# Altium project MainBoard.PrjPcb (part 2 of 2)

## Sheet MainBoard_PERIPH.SchDoc
size 594 x 420 mm; DocumentNumber: VSL.23-MOTHERBOARD; SheetNumber: 5; Format: A2
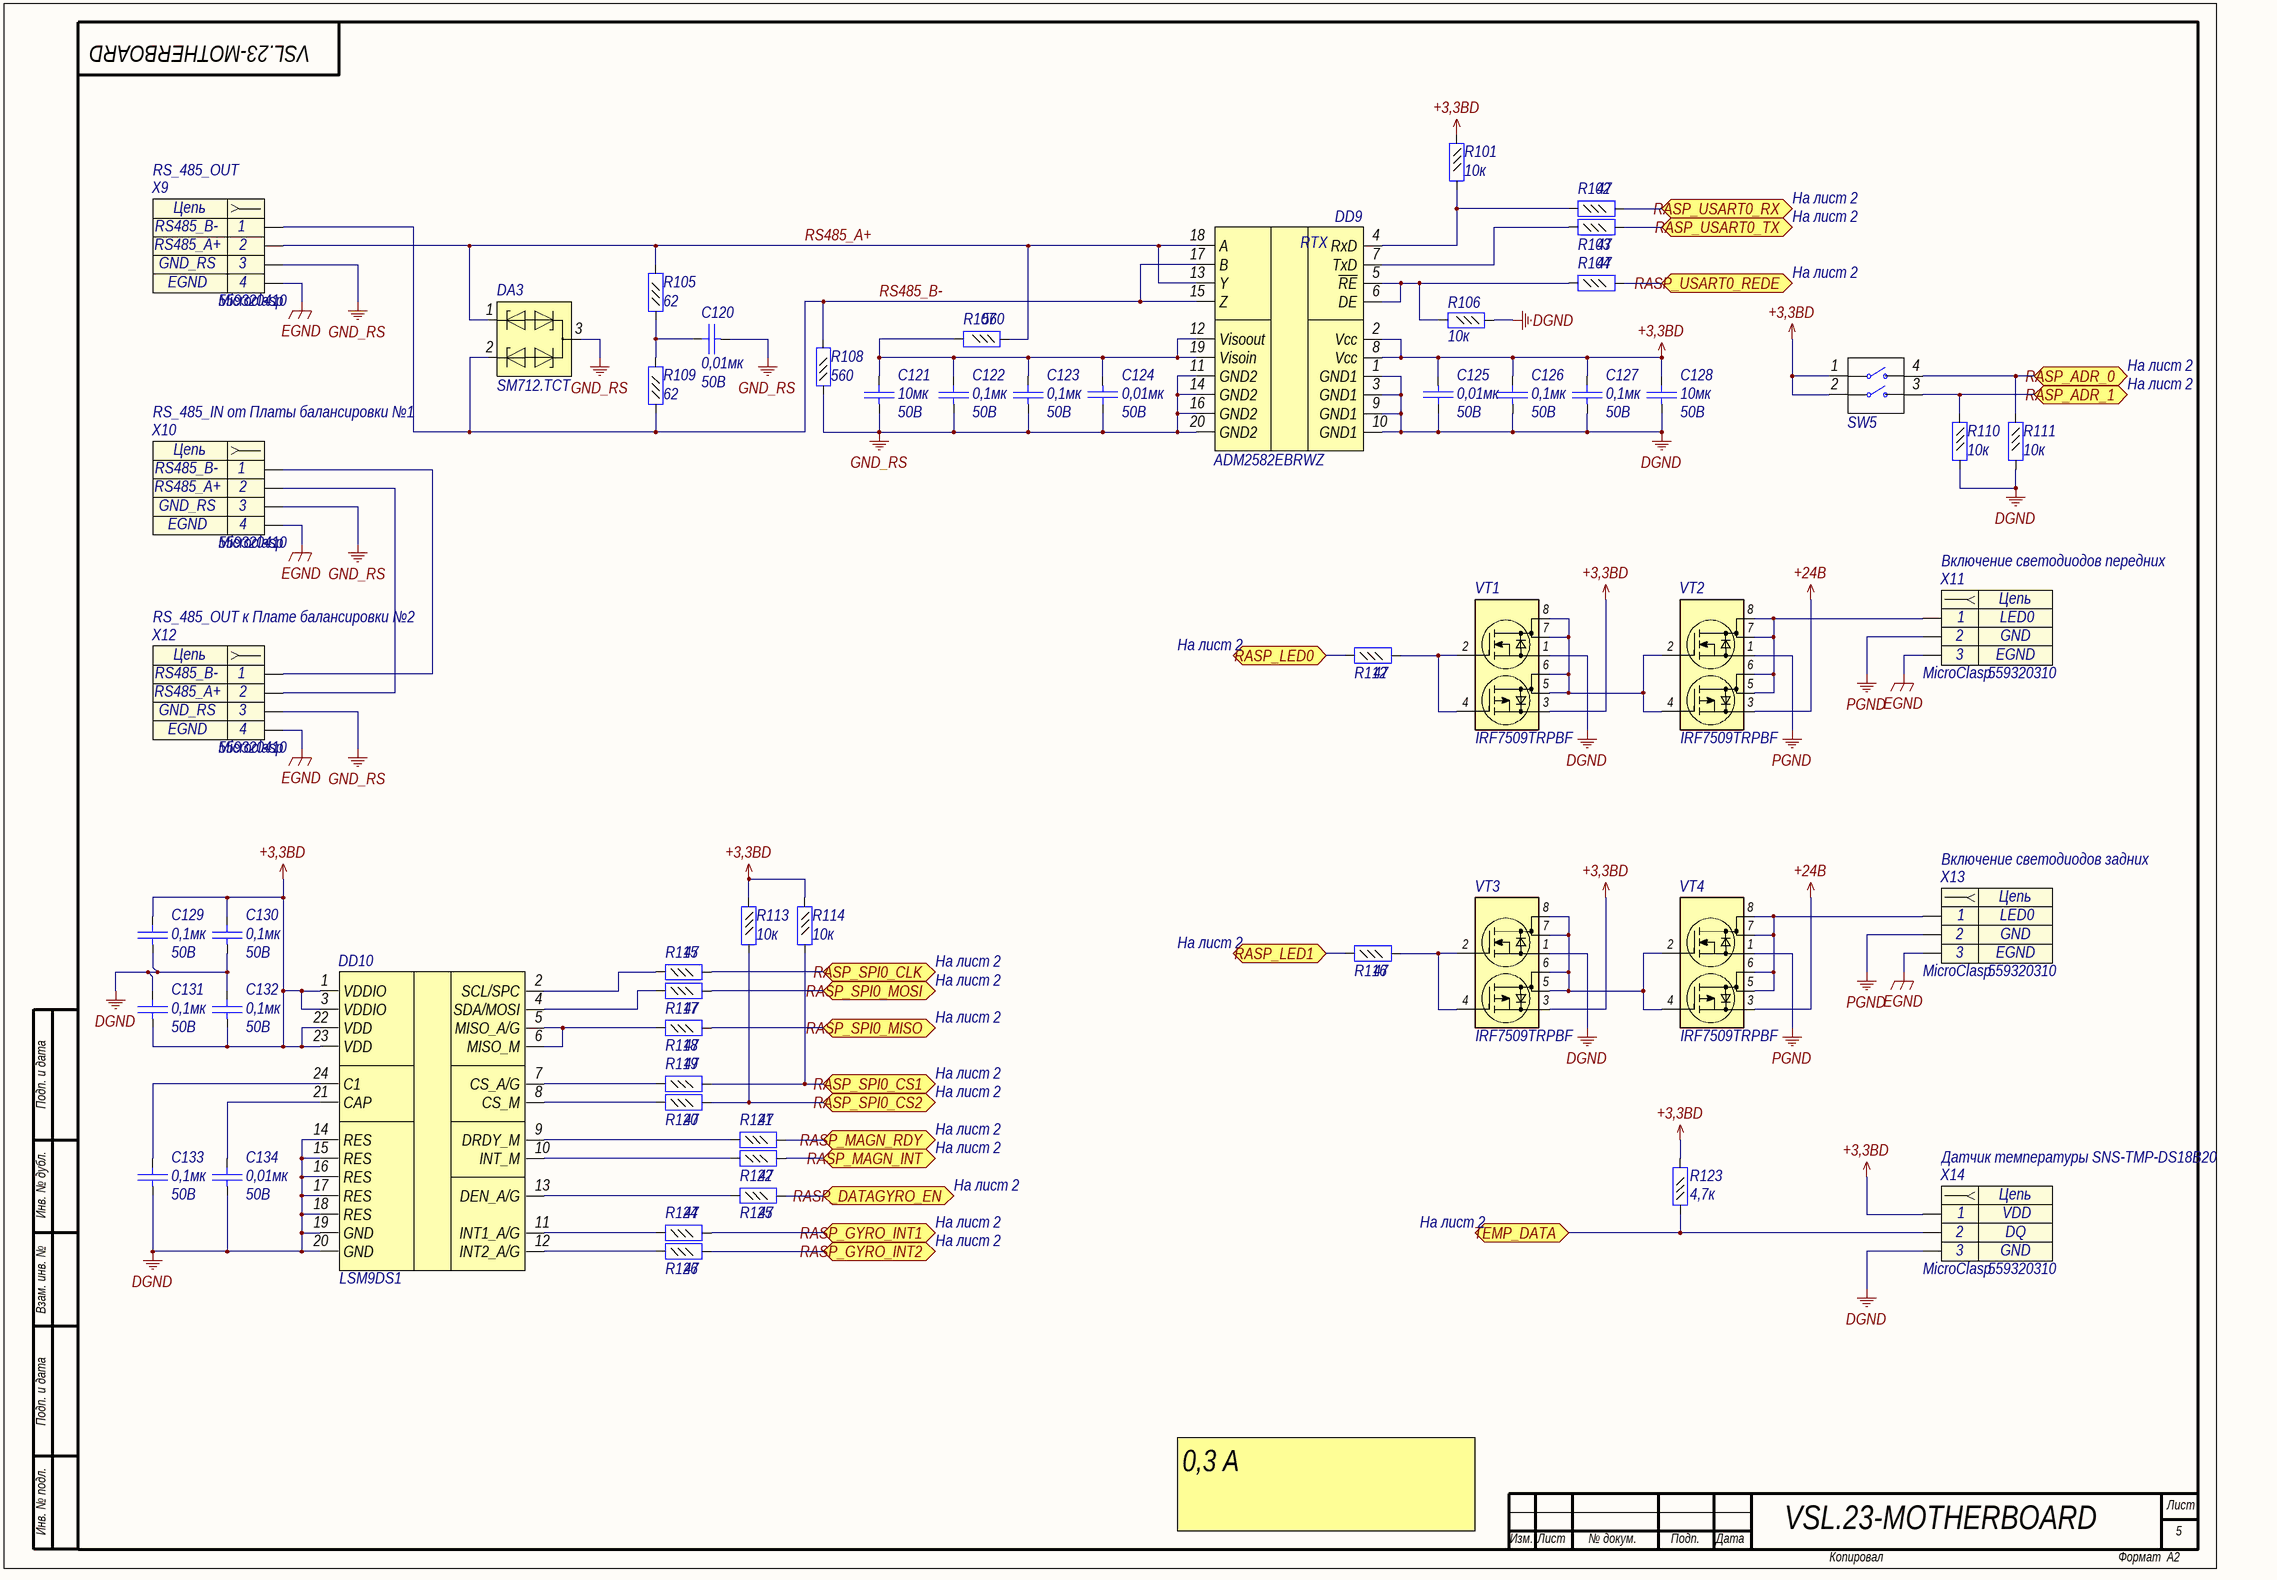
[diagram p4: MainBoard_PERIPH.SchDoc]

### Parts
C120  value 0,01мк  Voltage: 50B  [C0402]  (hidden comment: Capacitor)
C121  Voltage: 50В  [C1210]  (hidden comment: 10мк)
C122  value 0,1мк  Voltage: 50В  [C0402]  (hidden comment: Capacitor)
C123  value 0,1мк  Voltage: 50В  [C0402]  (hidden comment: Capacitor)
C124  Voltage: 50B  [C0402]  (hidden comment: 0,01мк)
C125  Voltage: 50B  [C0402]  (hidden comment: 0,01мк)
C126  value 0,1мк  Voltage: 50В  [C0402]  (hidden comment: Capacitor)
C127  value 0,1мк  Voltage: 50В  [C0402]  (hidden comment: Capacitor)
C128  Voltage: 50В  [C1210]  (hidden comment: 10мк)
C129  value 0,1мк  Voltage: 50В  [C0402]  (hidden comment: Capacitor)
C130  value 0,1мк  Voltage: 50В  [C0402]  (hidden comment: Capacitor)
C131  value 0,1мк  Voltage: 50В  [C0402]  (hidden comment: Capacitor)
C132  value 0,1мк  Voltage: 50В  [C0402]  (hidden comment: Capacitor)
C133  value 0,1мк  Voltage: 50В  [C0402]  (hidden comment: Capacitor)
C134  Voltage: 50B  [C0402]  (hidden comment: 0,01мк)
DA3  Part Number: SM712.TCT  [SOT23-3]  (hidden comment: SM712)
DD9  Part Number: ADM2582EBRWZ  [SO20W]
DD10  LSM9DS1  [LGA24]
R101  value 10к  [R0402]  (hidden comment: Resistor_0,062Вт)
R102  value 47  [R0402]  (hidden comment: Resistor_0,062Вт)
R103  value 47  [R0402]  (hidden comment: Resistor_0,062Вт)
R104  value 47  [R0402]  (hidden comment: Resistor_0,062Вт)
R105  value 62  [R0402]  (hidden comment: Resistor_0,062Вт)
R106  value 10к  [R0402]  (hidden comment: Resistor_0,062Вт)
R107  value 560  [R0402]  (hidden comment: Resistor_0,062Вт)
R108  value 560  [R0402]  (hidden comment: Resistor_0,062Вт)
R109  value 62  [R0402]  (hidden comment: Resistor_0,062Вт)
R110  value 10к  [R0402]  (hidden comment: Resistor_0,062Вт)
R111  value 10к  [R0402]  (hidden comment: Resistor_0,062Вт)
R112  value 47  [R0402]  (hidden comment: Resistor_0,062Вт)
R113  value 10к  [R0402]  (hidden comment: Resistor_0,062Вт)
R114  value 10к  [R0402]  (hidden comment: Resistor_0,062Вт)
R115  value 47  [R0402]  (hidden comment: Resistor_0,062Вт)
R116  value 47  [R0402]  (hidden comment: Resistor_0,062Вт)
R117  value 47  [R0402]  (hidden comment: Resistor_0,062Вт)
R118  value 47  [R0402]  (hidden comment: Resistor_0,062Вт)
R119  value 47  [R0402]  (hidden comment: Resistor_0,062Вт)
R120  value 47  [R0402]  (hidden comment: Resistor_0,062Вт)
R121  value 47  [R0402]  (hidden comment: Resistor_0,062Вт)
R122  value 47  [R0402]  (hidden comment: Resistor_0,062Вт)
R123  value 4,7к  [R0402]  (hidden comment: Resistor_0,062Вт)
R124  value 47  [R0402]  (hidden comment: Resistor_0,062Вт)
R125  value 47  [R0402]  (hidden comment: Resistor_0,062Вт)
R126  value 47  [R0402]  (hidden comment: Resistor_0,062Вт)
SW5  DS1040-02  [2PAD_ADR]  (value not drawn)
VT1  IRF7509TRPBF  [Micro8]
VT2  IRF7509TRPBF  [Micro8]
VT3  IRF7509TRPBF  [Micro8]
VT4  IRF7509TRPBF  [Micro8]
X9  RS_485_OUT  Part Number: 559320410  [MOLEX_559320410]
X10  RS_485_IN от Платы балансировки №1  Part Number: 559320410  [MOLEX_559320410]
X11  Включение светодиодов передних  Part Name: MicroClasp  Part Number: 559320310  [MOLEX_559320310]
X12  RS_485_OUT к Плате балансировки №2  Part Number: 559320410  [MOLEX_559320410]
X13  Включение светодиодов задних  Part Name: MicroClasp  Part Number: 559320310  [MOLEX_559320310]
X14  Датчик температуры SNS-TMP-DS18B20  Part Name: MicroClasp  Part Number: 559320310  [MOLEX_559320310]

### Ports
RASP_ADR_0, RASP_ADR_1, RASP_DATAGYRO_EN, RASP_GYRO_INT1, RASP_GYRO_INT2, RASP_LED0, RASP_LED1, RASP_MAGN_INT, RASP_MAGN_RDY, RASP_SPI0_CLK, RASP_SPI0_CS1, RASP_SPI0_CS2, RASP_SPI0_MISO, RASP_SPI0_MOSI, RASP_USART0_REDE, RASP_USART0_RX, RASP_USART0_TX, TEMP_DATA

### Nets
+3,3BD: C125.1 C126.2 C127.2 C128.2 C129.2 C130.2 C131.1 C132.1 DD9.2(Vcc) DD9.8(Vcc) DD10.1(VDDIO) DD10.3(VDDIO) DD10.22(VDD) DD10.23(VDD) R101.1 R113.1 R114.1 R123.2 SW5.1 SW5.2 VT1.3(S2) VT3.3(S2) X14.1
+24B: VT2.3(S2) VT4.3(S2)
DGND: C125.2 C126.1 C127.1 C128.1 C129.1 C130.1 C131.2 C132.2 C133.1 C134.1 DD9.1(GND1) DD9.3(GND1) DD9.9(GND1) DD9.10(GND1) DD10.14(RES) DD10.15(RES) DD10.16(RES) DD10.17(RES) DD10.18(RES) DD10.19(GND) DD10.20(GND) R106.1 R110.2 R111.2 VT1.1(S1) VT3.1(S1) X14.3
EGND: X9.4 X10.4 X11.3 X12.4 X13.3
GND_RS: C120.1 C121.1 C122.1 C123.1 C124.2 DA3.3 DD9.11(GND2) DD9.14(GND2) DD9.16(GND2) DD9.20(GND2) R108.1 X9.3 X10.3 X12.3
PGND: VT2.1(S1) VT4.1(S1) X11.2 X13.2
RS485_A+: DA3.1 DD9.13(Y) DD9.18(A) R105.2 R107.1 X9.2
RS485_B-: DA3.2 DD9.15(Z) DD9.17(B) R108.2 R109.1 X9.1
NetC120_2: C120.2 R105.1 R109.2
NetC121_2: C121.2 C122.2 C123.2 C124.1 DD9.12(Visoout) DD9.19(Visoin) R107.2
NetC133_2: C133.2 DD10.24(C1)
NetC134_2: C134.2 DD10.21(CAP)
NetDD1_21: R115.2 ; port RASP_SPI0_CLK
NetDD1_22: R118.2 ; port RASP_SPI0_MISO
NetDD1_23: R117.2 ; port RASP_SPI0_MOSI
NetDD9_4: DD9.4(RxD) R101.2 R102.1
NetDD9_5: DD9.5(~{RE}) DD9.6(DE) R104.1 R106.2
NetDD9_7: DD9.7(TxD) R103.1
NetDD10_2: DD10.2(SCL/SPC) R115.1
NetDD10_4: DD10.4(SDA/MOSI) R117.1
NetDD10_5: DD10.5(MISO_A/G) DD10.6(MISO_M) R118.1
NetDD10_7: DD10.7(CS_A/G) R119.1
NetDD10_8: DD10.8(CS_M) R120.1
NetDD10_9: DD10.9(DRDY_M) R121.1
NetDD10_10: DD10.10(INT_M) R122.1
NetDD10_11: DD10.11(INT1_A/G) R124.1
NetDD10_12: DD10.12(INT2_A/G) R126.1
NetDD10_13: DD10.13(DEN_A/G) R125.1
NetR102_2: R102.2 ; port RASP_USART0_RX
NetR103_2: R103.2 ; port RASP_USART0_TX
NetR104_2: R104.2 ; port RASP_USART0_REDE
NetR110_1: R110.1 SW5.3 ; port RASP_ADR_1
NetR111_1: R111.1 SW5.4 ; port RASP_ADR_0
NetR112_1: R112.1 ; port RASP_LED0
NetR112_2: R112.2 VT1.2(G1) VT1.4(G2)
NetR113_2: R113.2 R120.2 ; port RASP_SPI0_CS2
NetR114_2: R114.2 R119.2 ; port RASP_SPI0_CS1
NetR116_1: R116.1 ; port RASP_LED1
NetR116_2: R116.2 VT3.2(G1) VT3.4(G2)
NetR121_2: R121.2 ; port RASP_MAGN_RDY
NetR122_2: R122.2 ; port RASP_MAGN_INT
NetR123_1: R123.1 X14.2 ; port TEMP_DATA
NetR124_2: R124.2 ; port RASP_GYRO_INT1
NetR125_2: R125.2 ; port RASP_DATAGYRO_EN
NetR126_2: R126.2 ; port RASP_GYRO_INT2
NetVT1_5: VT1.5(D2) VT1.6(D2) VT1.7(D1) VT1.8(D1) VT2.2(G1) VT2.4(G2)
NetVT2_5: VT2.5(D2) VT2.6(D2) VT2.7(D1) VT2.8(D1) X11.1
NetVT3_5: VT3.5(D2) VT3.6(D2) VT3.7(D1) VT3.8(D1) VT4.2(G1) VT4.4(G2)
NetVT4_5: VT4.5(D2) VT4.6(D2) VT4.7(D1) VT4.8(D1) X13.1
NetX10_1: X10.1 X12.1
NetX10_2: X10.2 X12.2

### Notes on the sheet
- На лист 2
- Microclasp
- Подп. и дата
- Инв. № дубл.
- Взам. инв. №
- Инв. № подл.
- 0,3 А
- Лист
- Изм.
- № докум.
- Подп.
- Дата
- Копировал
- Формат
- (in symbol connect96) Цепь
- (in symbol connect97) Цепь
- (in symbol interf21) RTX

### Library data of the parts
C120 C124 C125 C134 = cap42: Конденсатор; Part Name: Ceramic; Manufacture: Murata; Part Number: GRM155R71H103K; id: cap42; TKE: X7R
  C124 C125 C134: Value: 0,01мк
C121 C128 = cap297: Конденсатор; Part Name: MLCC; Manufacture: TDK; Part Number: C3225X7R1H106K250AC; id: cap297; TKE: X7R; tga: 0,10%; Value: 10мк
C122 C123 C126 C127 C129-C133 = cap277: Конденсатор; Part Name: Ceramic; Manufacture: Murata; Part Number: GRM155R71H104KE14D; id: cap277; TKE: X7R; tga: 0,10%
DA3 = SM712.TCT: TVS; Part Name: TVS DiodeCommon-Mode RS-485; Manufacture: Semtech; id: esd6; Max Reverse Voltage: 12B; Breakdown Voltage: 13,3B; Leakage current: 20uA; Capacitance: 75pF; Number of Channels: 2
DD9 = interf21: Приемопередатчик RS485 изолированный; Part Name: Signal and Power Isolated RS-485; Manufacture: Analog Devices; Speed: 16Mbps; Type Supply: Single Polar; id: interf21
DD10 = LSM9DS1: 3D accelerometer, 3D gyroscope, 3D magnetometer; Manufacture: ST Microelectronics; id: sensor6; Type sensor: Accelerometer,gyroscope,magnetometer; Interface: I2C,SPI; Part Number: LSM9DS1; Part Name: 3D accelerometer, 3D gyroscope, 3D magnetometer
R101 R106 R110 R111 R113 R114 = res294: Резистор; Manufacture: Yageo; Part Number: RC0402FR-0710KL; id: res294; Accuracy: 0,01; Part Name: Resistor; Power: 0,062Вт
R102-R104 R112 R115-R122 R124-R126 = res238: Резистор; Manufacture: Yageo; Part Number: RC0402FR-0747RL; id: res238; Accuracy: 0,01; Part Name: Resistor; Power: 0,062Вт
R105 R109 = res241: Резистор; Manufacture: Yageo; Part Number: RC0402FR-0762RL; id: res241; Accuracy: 0,01; Part Name: Resistor; Power: 0,062Вт
R107 R108 = res264: Резистор; Manufacture: Yageo; Part Number: RC0402FR-07560RL; id: res264; Accuracy: 0,01; Part Name: Resistor; Power: 0,062Вт
R123 = res286: Резистор; Manufacture: Yageo; Part Number: RC0402FR-074K7; id: res286; Accuracy: 0,01; Part Name: Resistor; Power: 0,062Вт
SW5 = btn8: DIP переключатель; Part Name: Перемычка адреса; id: btn8
VT1-VT4 = mosfert3: Комплементарная сборка МОП; Manufacturer: International Rectifier; Structure: n-p-channel; V drain-source max: 30B; Rds: 0,11Ohm; Gate-to-source voltage: (+-)20B; Continuous drain current: 2A; Pulsed drain current: 16A; Power dissipation: 1,25W; id: mosfert3; Part Number: IRF7509TRPBF
X9 X10 X12 = connect97: Разъем - 4 конт. розетка; Part Name: MicroClasp Wire-to-Board Header; Manufacture: Molex; Contact_1: RS485_B-; Contact_2: RS485_A+; Contact_3: GND_RS; Contact_4: EGND; Etch: 2mm; id: connect97
X11 X13 = connect96: Разъем - 3 конт. розетка; Manufacture: Molex; Contact_1: LED0; Contact_2: GND; Contact_3: EGND; Etch: 2mm; id: connect96
X14 = connect96: Разъем - 3 конт. розетка; Manufacture: Molex; Contact_1: VDD; Contact_2: DQ; Contact_3: GND; Etch: 2mm; id: connect96

## Sheet MainBoard_RELAY.SchDoc
size 594 x 420 mm; DocumentNumber: VSL.23-MOTHERBOARD; SheetNumber: 6; Format: A2
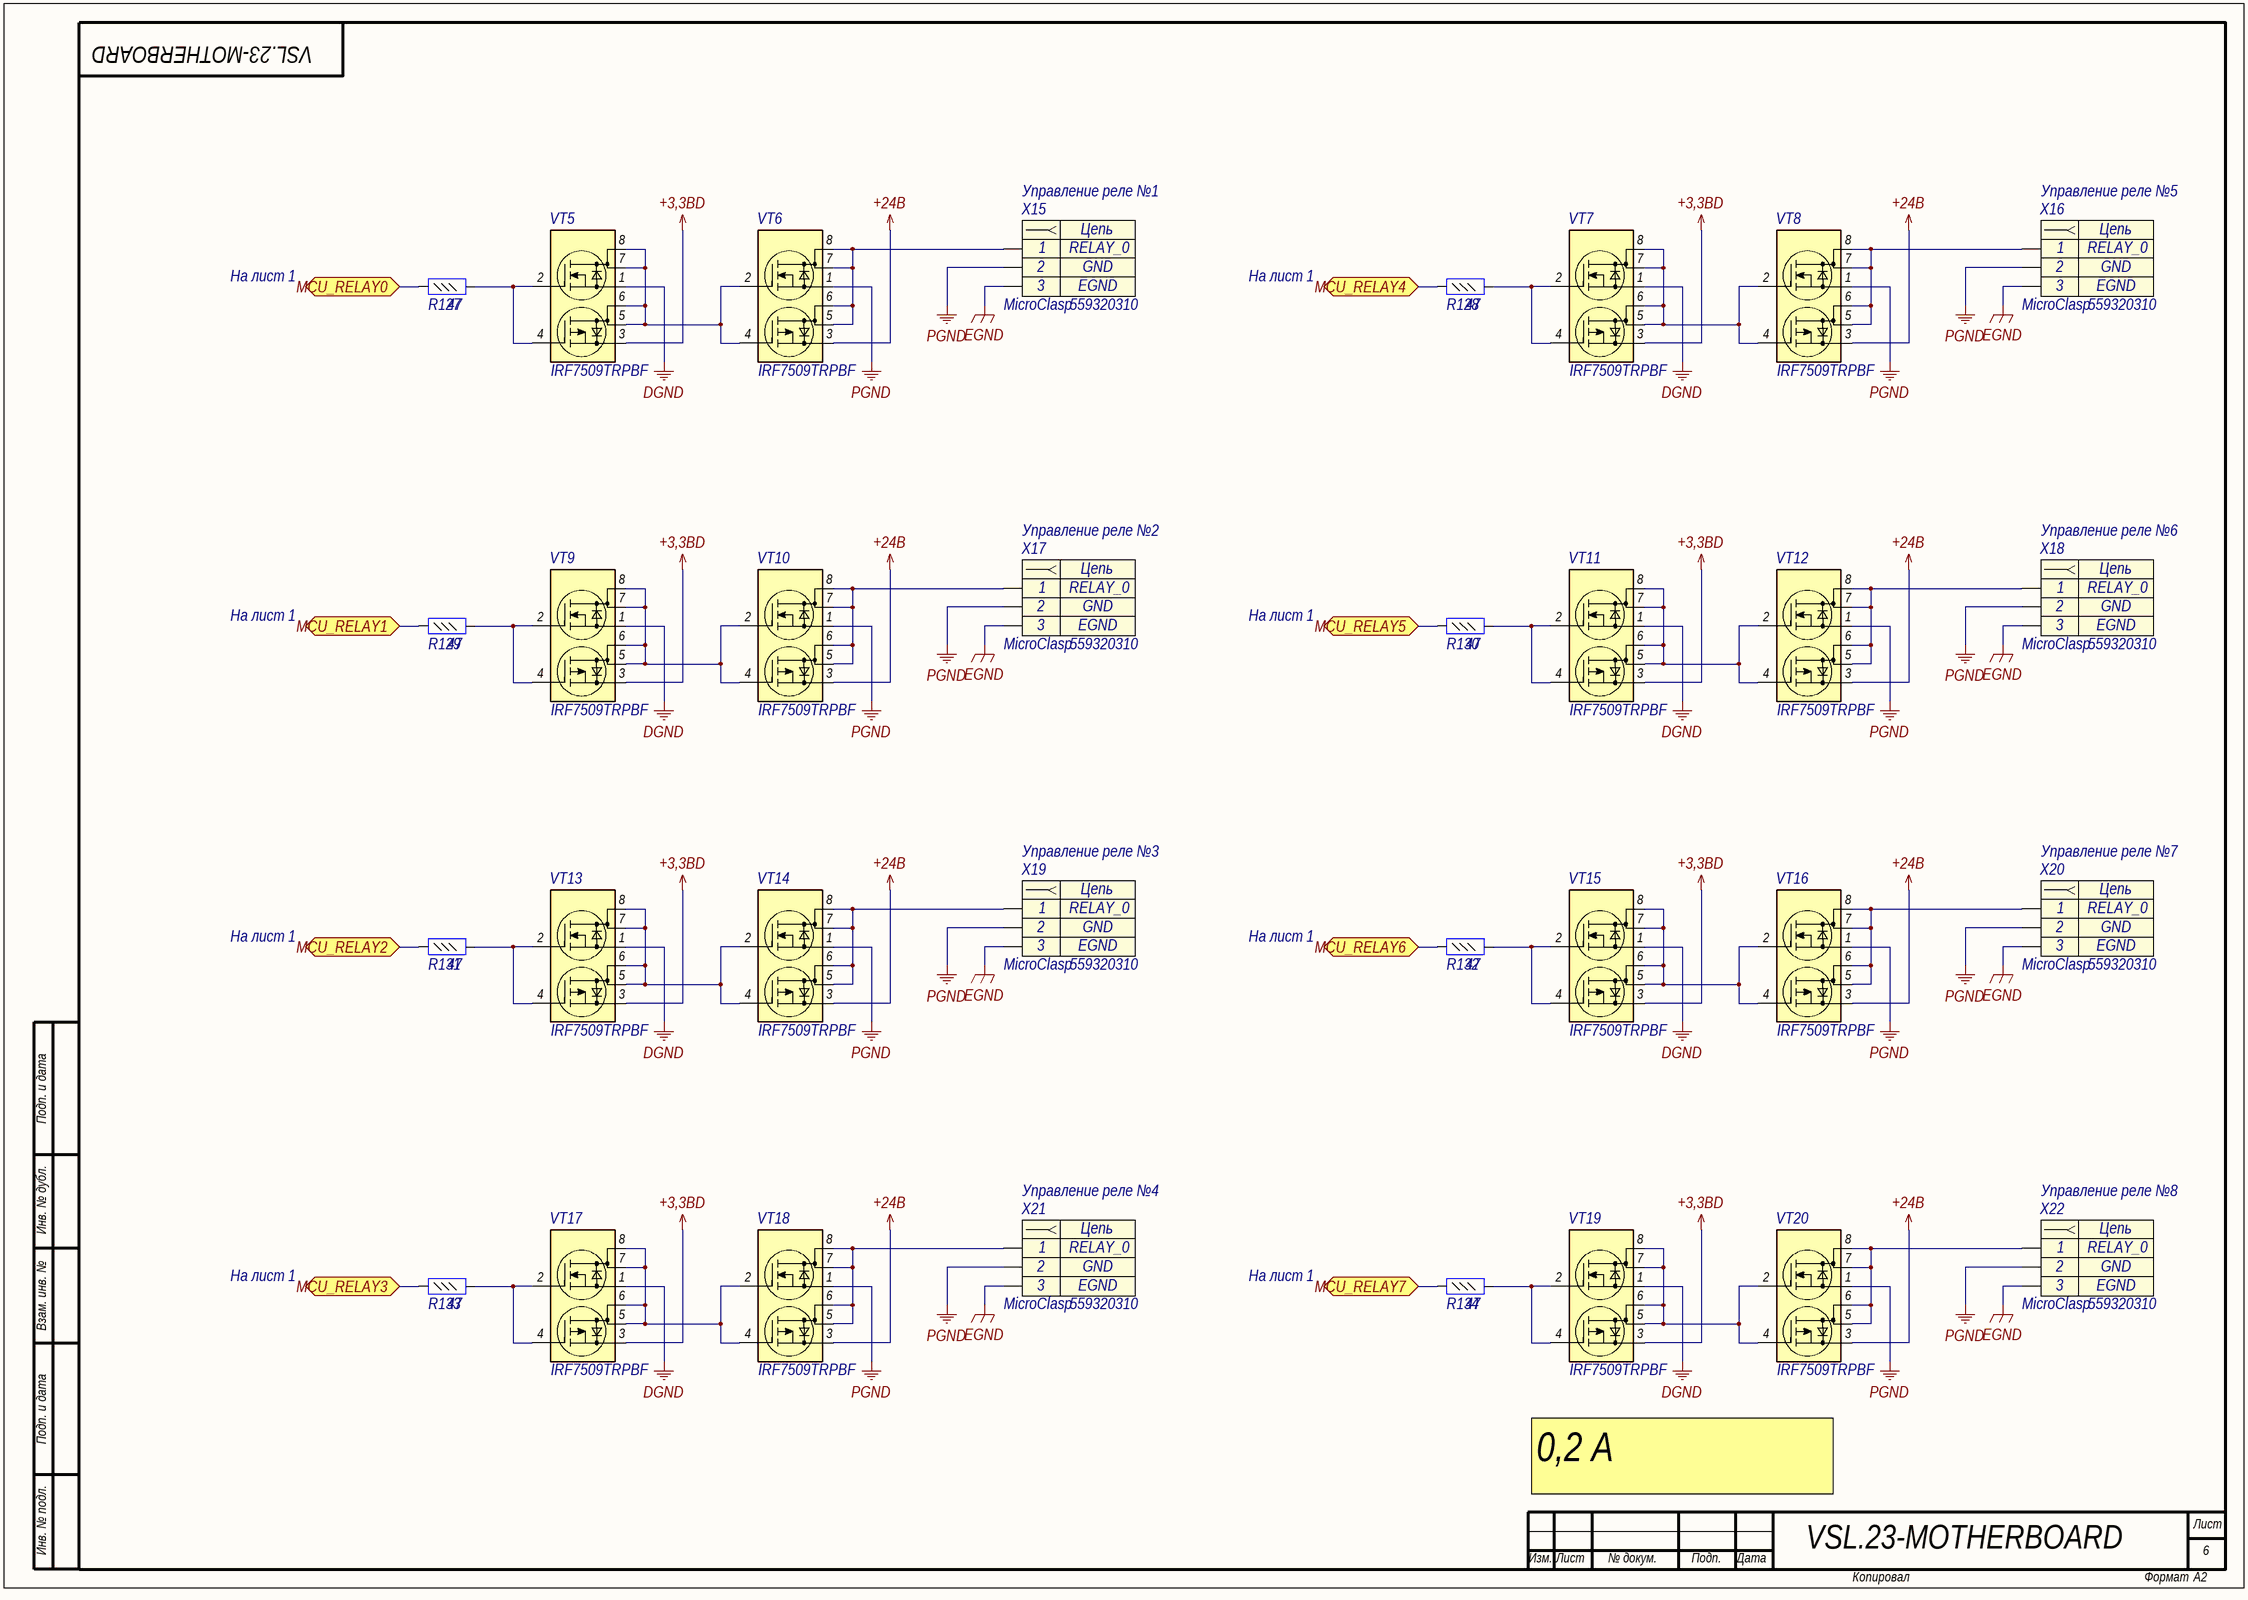
[diagram p5: MainBoard_RELAY.SchDoc]

### Parts
R127  value 47  [R0402]  (hidden comment: Resistor_0,062Вт)
R128  value 47  [R0402]  (hidden comment: Resistor_0,062Вт)
R129  value 47  [R0402]  (hidden comment: Resistor_0,062Вт)
R130  value 47  [R0402]  (hidden comment: Resistor_0,062Вт)
R131  value 47  [R0402]  (hidden comment: Resistor_0,062Вт)
R132  value 47  [R0402]  (hidden comment: Resistor_0,062Вт)
R133  value 47  [R0402]  (hidden comment: Resistor_0,062Вт)
R134  value 47  [R0402]  (hidden comment: Resistor_0,062Вт)
VT5  IRF7509TRPBF  [Micro8]
VT6  IRF7509TRPBF  [Micro8]
VT7  IRF7509TRPBF  [Micro8]
VT8  IRF7509TRPBF  [Micro8]
VT9  IRF7509TRPBF  [Micro8]
VT10  IRF7509TRPBF  [Micro8]
VT11  IRF7509TRPBF  [Micro8]
VT12  IRF7509TRPBF  [Micro8]
VT13  IRF7509TRPBF  [Micro8]
VT14  IRF7509TRPBF  [Micro8]
VT15  IRF7509TRPBF  [Micro8]
VT16  IRF7509TRPBF  [Micro8]
VT17  IRF7509TRPBF  [Micro8]
VT18  IRF7509TRPBF  [Micro8]
VT19  IRF7509TRPBF  [Micro8]
VT20  IRF7509TRPBF  [Micro8]
X15  Управление реле №1  Part Name: MicroClasp  Part Number: 559320310  [MOLEX_559320310]
X16  Управление реле №5  Part Name: MicroClasp  Part Number: 559320310  [MOLEX_559320310]
X17  Управление реле №2  Part Name: MicroClasp  Part Number: 559320310  [MOLEX_559320310]
X18  Управление реле №6  Part Name: MicroClasp  Part Number: 559320310  [MOLEX_559320310]
X19  Управление реле №3  Part Name: MicroClasp  Part Number: 559320310  [MOLEX_559320310]
X20  Управление реле №7  Part Name: MicroClasp  Part Number: 559320310  [MOLEX_559320310]
X21  Управление реле №4  Part Name: MicroClasp  Part Number: 559320310  [MOLEX_559320310]
X22  Управление реле №8  Part Name: MicroClasp  Part Number: 559320310  [MOLEX_559320310]

### Ports
MCU_RELAY0, MCU_RELAY1, MCU_RELAY2, MCU_RELAY3, MCU_RELAY4, MCU_RELAY5, MCU_RELAY6, MCU_RELAY7

### Nets
+3,3BD: VT5.3(S2) VT7.3(S2) VT9.3(S2) VT11.3(S2) VT13.3(S2) VT15.3(S2) VT17.3(S2) VT19.3(S2)
+24B: VT6.3(S2) VT8.3(S2) VT10.3(S2) VT12.3(S2) VT14.3(S2) VT16.3(S2) VT18.3(S2) VT20.3(S2)
DGND: VT5.1(S1) VT7.1(S1) VT9.1(S1) VT11.1(S1) VT13.1(S1) VT15.1(S1) VT17.1(S1) VT19.1(S1)
EGND: X15.3 X16.3 X17.3 X18.3 X19.3 X20.3 X21.3 X22.3
PGND: VT6.1(S1) VT8.1(S1) VT10.1(S1) VT12.1(S1) VT14.1(S1) VT16.1(S1) VT18.1(S1) VT20.1(S1) X15.2 X16.2 X17.2 X18.2 X19.2 X20.2 X21.2 X22.2
NetDD1_8: R127.1 ; port MCU_RELAY0
NetDD1_9: R129.1 ; port MCU_RELAY1
NetDD1_10: R131.1 ; port MCU_RELAY2
NetDD1_11: R133.1 ; port MCU_RELAY3
NetDD1_24: R128.1 ; port MCU_RELAY4
NetDD1_25: R130.1 ; port MCU_RELAY5
NetDD1_37: R132.1 ; port MCU_RELAY6
NetDD1_38: R134.1 ; port MCU_RELAY7
NetR127_2: R127.2 VT5.2(G1) VT5.4(G2)
NetR128_2: R128.2 VT7.2(G1) VT7.4(G2)
NetR129_2: R129.2 VT9.2(G1) VT9.4(G2)
NetR130_2: R130.2 VT11.2(G1) VT11.4(G2)
NetR131_2: R131.2 VT13.2(G1) VT13.4(G2)
NetR132_2: R132.2 VT15.2(G1) VT15.4(G2)
NetR133_2: R133.2 VT17.2(G1) VT17.4(G2)
NetR134_2: R134.2 VT19.2(G1) VT19.4(G2)
NetVT5_5: VT5.5(D2) VT5.6(D2) VT5.7(D1) VT5.8(D1) VT6.2(G1) VT6.4(G2)
NetVT6_5: VT6.5(D2) VT6.6(D2) VT6.7(D1) VT6.8(D1) X15.1
NetVT7_5: VT7.5(D2) VT7.6(D2) VT7.7(D1) VT7.8(D1) VT8.2(G1) VT8.4(G2)
NetVT8_5: VT8.5(D2) VT8.6(D2) VT8.7(D1) VT8.8(D1) X16.1
NetVT9_5: VT9.5(D2) VT9.6(D2) VT9.7(D1) VT9.8(D1) VT10.2(G1) VT10.4(G2)
NetVT10_5: VT10.5(D2) VT10.6(D2) VT10.7(D1) VT10.8(D1) X17.1
NetVT11_5: VT11.5(D2) VT11.6(D2) VT11.7(D1) VT11.8(D1) VT12.2(G1) VT12.4(G2)
NetVT12_5: VT12.5(D2) VT12.6(D2) VT12.7(D1) VT12.8(D1) X18.1
NetVT13_5: VT13.5(D2) VT13.6(D2) VT13.7(D1) VT13.8(D1) VT14.2(G1) VT14.4(G2)
NetVT14_5: VT14.5(D2) VT14.6(D2) VT14.7(D1) VT14.8(D1) X19.1
NetVT15_5: VT15.5(D2) VT15.6(D2) VT15.7(D1) VT15.8(D1) VT16.2(G1) VT16.4(G2)
NetVT16_5: VT16.5(D2) VT16.6(D2) VT16.7(D1) VT16.8(D1) X20.1
NetVT17_5: VT17.5(D2) VT17.6(D2) VT17.7(D1) VT17.8(D1) VT18.2(G1) VT18.4(G2)
NetVT18_5: VT18.5(D2) VT18.6(D2) VT18.7(D1) VT18.8(D1) X21.1
NetVT19_5: VT19.5(D2) VT19.6(D2) VT19.7(D1) VT19.8(D1) VT20.2(G1) VT20.4(G2)
NetVT20_5: VT20.5(D2) VT20.6(D2) VT20.7(D1) VT20.8(D1) X22.1

### Notes on the sheet
- На лист 1
- Подп. и дата
- Инв. № дубл.
- Взам. инв. №
- 0,2 A
- Инв. № подл.
- Лист
- Изм.
- № докум.
- Подп.
- Дата
- Копировал
- Формат
- (in symbol connect96) Цепь

### Library data of the parts
R127-R134 = res238: as R102-R104 on sheet MainBoard_PERIPH; Part Name: Resistor; Power: 0,062Вт
VT5-VT20 = mosfert3: as VT1 on sheet MainBoard_PERIPH; id: mosfert3; Part Number: IRF7509TRPBF
X15-X22 = connect96: Разъем - 3 конт. розетка; Manufacture: Molex; Contact_1: RELAY_0; Contact_2: GND; Contact_3: EGND; Etch: 2mm; id: connect96

## Sheet MainBoard_PWR.SchDoc
size 594 x 420 mm; DocumentNumber: VSL.23-MOTHERBOARD; SheetNumber: 7; Format: A2
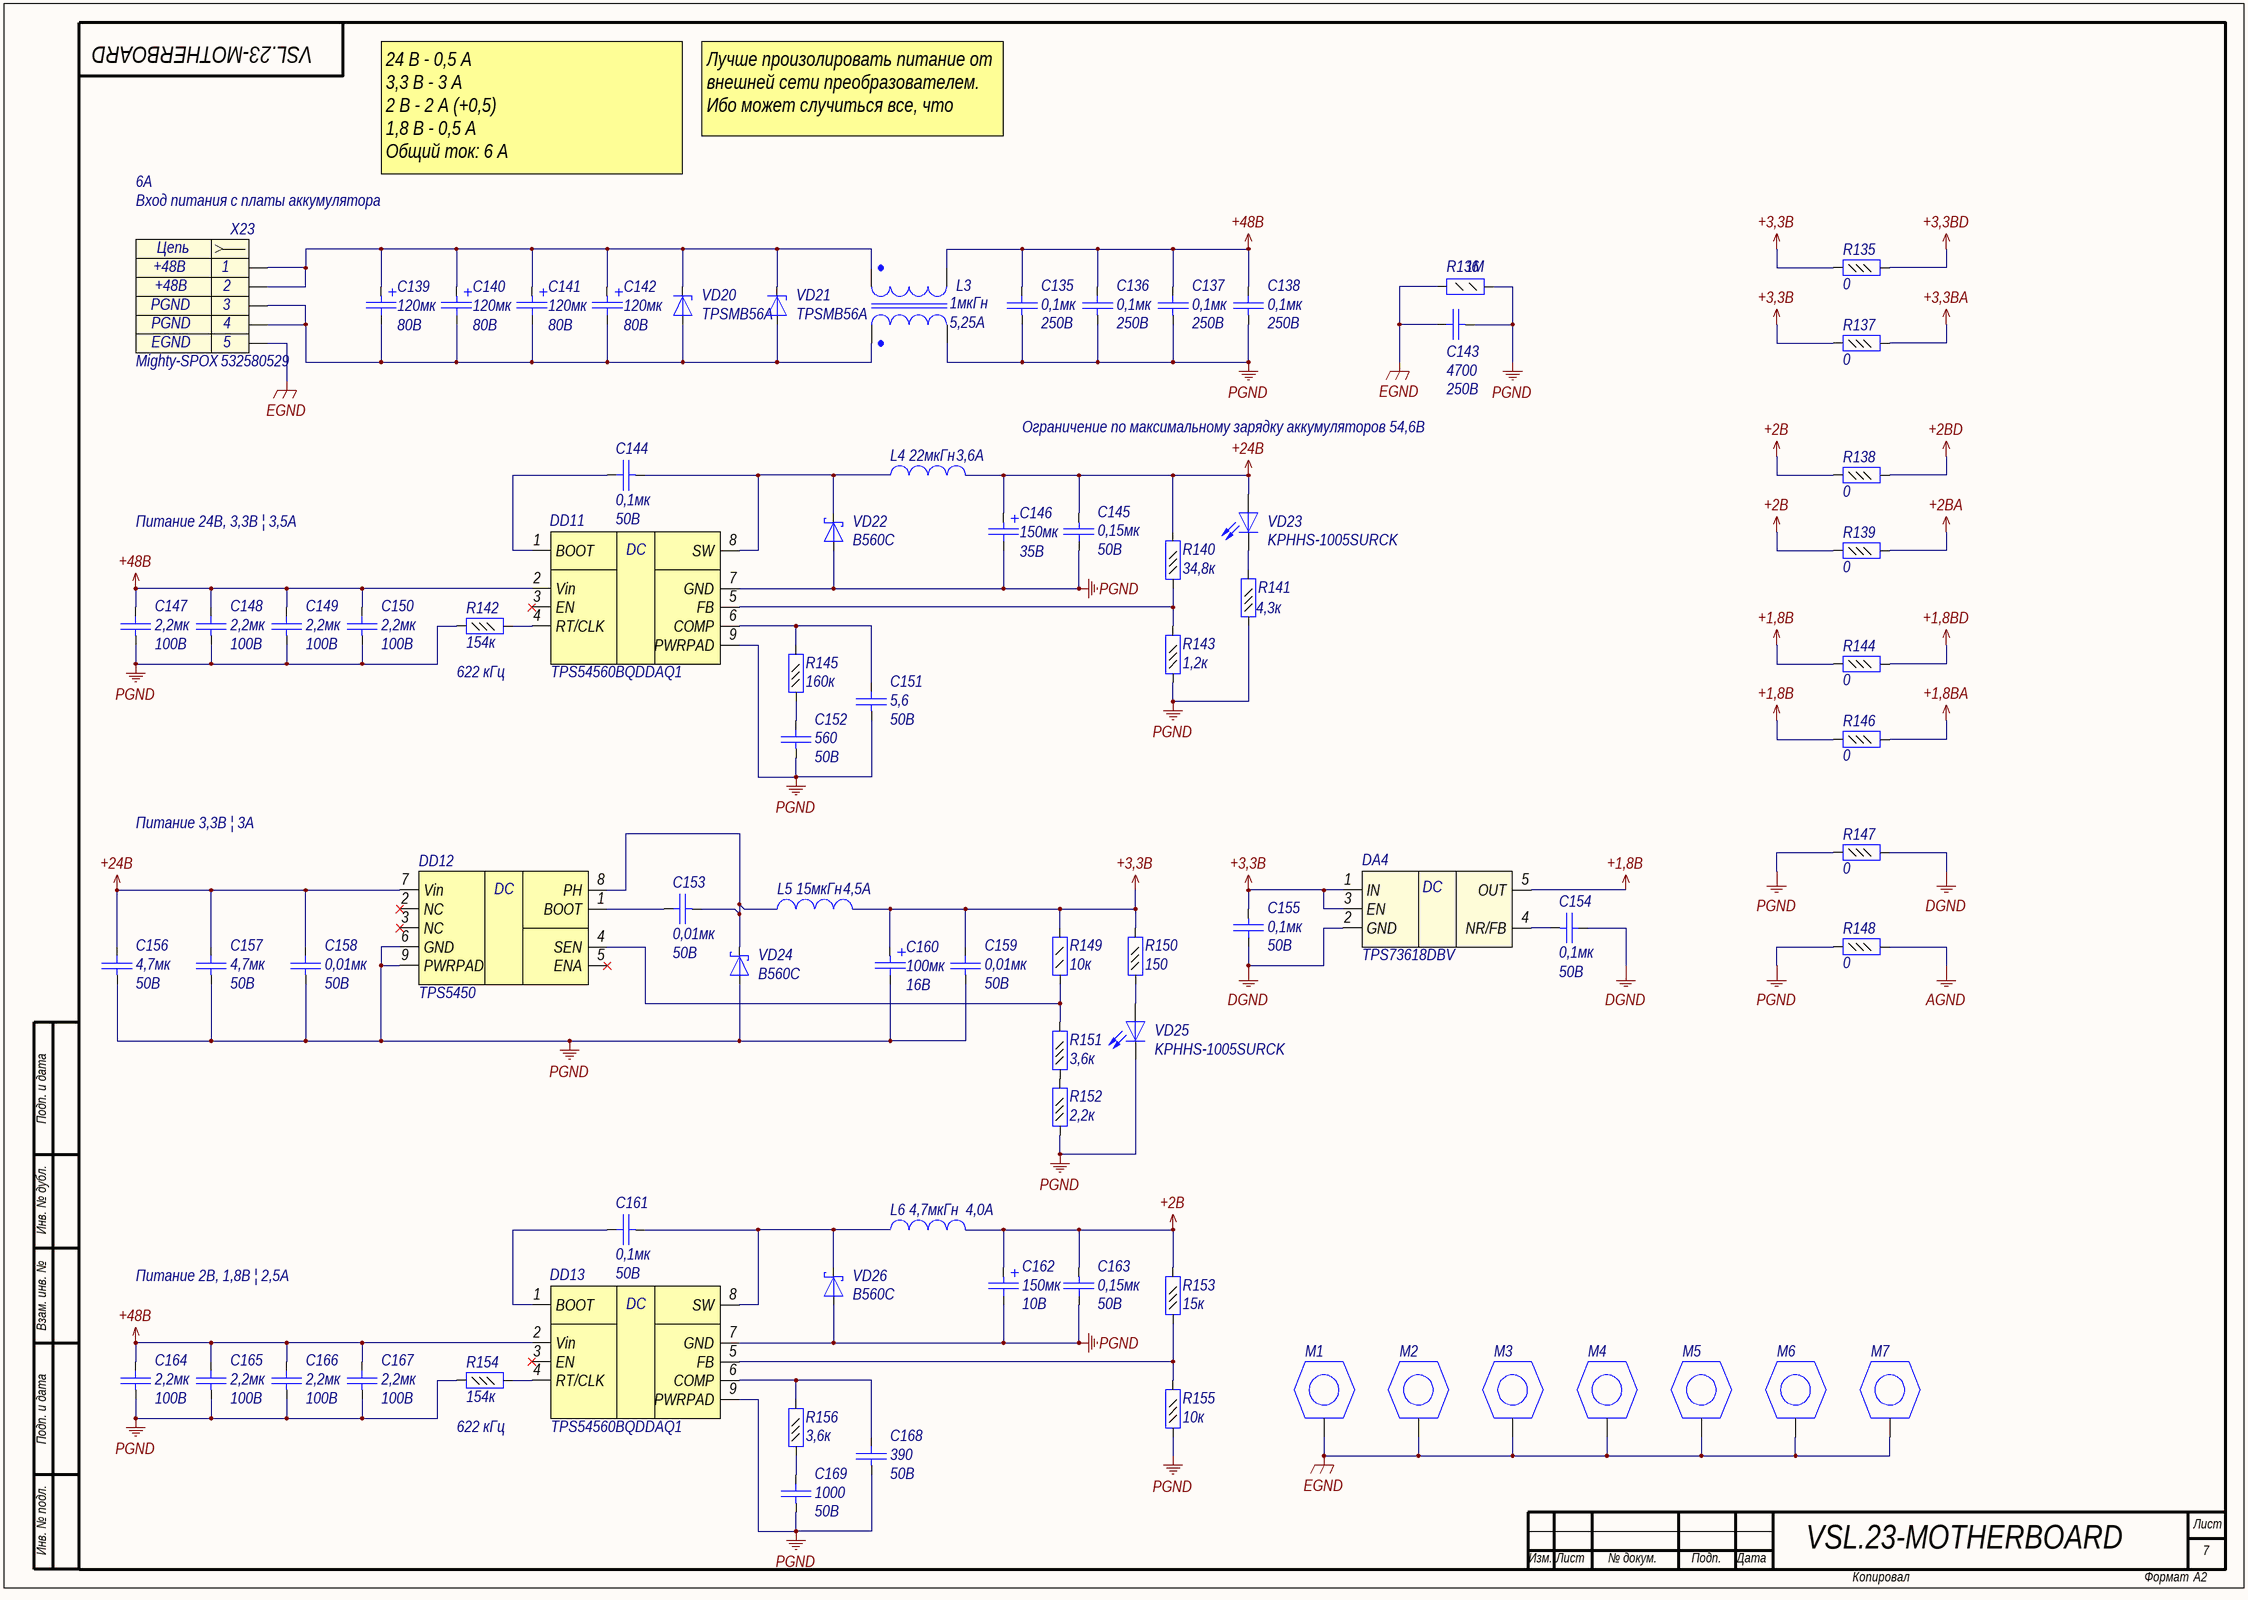
[diagram p6: MainBoard_PWR.SchDoc]

### Parts
C135  value 0,1мк  Voltage: 250В  [C1206]  (hidden comment: Capacitor)
C136  value 0,1мк  Voltage: 250В  [C1206]  (hidden comment: Capacitor)
C137  value 0,1мк  Voltage: 250В  [C1206]  (hidden comment: Capacitor)
C138  value 0,1мк  Voltage: 250В  [C1206]  (hidden comment: Capacitor)
C139  value 120мк  Voltage: 80В  [K50-35(8X20)_V]  (hidden comment: Capacitor_pol)
C140  value 120мк  Voltage: 80В  [K50-35(8X20)_V]  (hidden comment: Capacitor_pol)
C141  value 120мк  Voltage: 80В  [K50-35(8X20)_V]  (hidden comment: Capacitor_pol)
C142  value 120мк  Voltage: 80В  [K50-35(8X20)_V]  (hidden comment: Capacitor_pol)
C143  value 4700  Voltage: 250В  [C0805]  (hidden comment: Capacitor)
C144  Voltage: 50В  [C0402]  (hidden comment: 0,1мк)
C145  Voltage: 50В  [C1812]  (hidden comment: 0,15мк)
C146  value 150мк  Voltage: 35В  [Cap_SMD_radial_polar(8x10.2)]  (hidden comment: Capacitor_pol)
C147  Voltage: 100В  [C1812]  (hidden comment: 2,2мк)
C148  Voltage: 100В  [C1812]  (hidden comment: 2,2мк)
C149  Voltage: 100В  [C1812]  (hidden comment: 2,2мк)
C150  Voltage: 100В  [C1812]  (hidden comment: 2,2мк)
C151  Voltage: 50B  [C0402]  (hidden comment: 5,6)
C152  Voltage: 50B  [C0402]  (hidden comment: 560)
C153  Voltage: 50B  [C0402]  (hidden comment: 0,01мк)
C154  value 0,1мк  Voltage: 50В  [C0402]  (hidden comment: Capacitor)
C155  value 0,1мк  Voltage: 50В  [C0402]  (hidden comment: Capacitor)
C156  Voltage: 50В  [C0805]  (hidden comment: 4,7мк)
C157  Voltage: 50В  [C0805]  (hidden comment: 4,7мк)
C158  Voltage: 50B  [C0402]  (hidden comment: 0,01мк)
C159  Voltage: 50B  [C0402]  (hidden comment: 0,01мк)
C160  value 100мк  Voltage: 16В  [TANTAL CASE D]  (hidden comment: Capacitor_pol)
C161  Voltage: 50В  [C0402]  (hidden comment: 0,1мк)
C162  value 150мк  Voltage: 10B  [TANTAL CASE D]  (hidden comment: Capacitor_pol)
C163  Voltage: 50В  [C1812]  (hidden comment: 0,15мк)
C164  Voltage: 100В  [C1812]  (hidden comment: 2,2мк)
C165  Voltage: 100В  [C1812]  (hidden comment: 2,2мк)
C166  Voltage: 100В  [C1812]  (hidden comment: 2,2мк)
C167  Voltage: 100В  [C1812]  (hidden comment: 2,2мк)
C168  Voltage: 50B  [C0402]  (hidden comment: 390)
C169  Voltage: 50B  [C0402]  (hidden comment: 1000)
DA4  Part Number: TPS73618DBV  [SOT23-5]  (hidden comment: TPS736DBV)
DD11  Part Number: TPS54560BQDDAQ1  [SO Powerpad8]  (hidden comment: TPS54560)
DD12  TPS5450  [SO Powerpad8]
DD13  Part Number: TPS54560BQDDAQ1  [SO Powerpad8]  (hidden comment: TPS54560)
L3  value 1мкГн  Rated Current: 5,25A  [SRF0703]  (hidden comment: Dual-Winding Inductor)
L4  value 22мкГн  Rated Current: 3,6A  [IND_12.5x12.5]  (hidden comment: Inductor)
L5  value 15мкГн  Rated Current: 4,5A  [IND_12.5x12.5]  (hidden comment: Inductor)
L6  value 4,7мкГн  Rated Current: 4,0A  [SDR1006]  (hidden comment: Inductor)
M1  SCREW  [SCREW3]  (value not drawn)
M2  SCREW  [SCREW3]  (value not drawn)
M3  SCREW  [SCREW3]  (value not drawn)
M4  SCREW  [SCREW3]  (value not drawn)
M5  SCREW  [SCREW3]  (value not drawn)
M6  SCREW  [SCREW3]  (value not drawn)
M7  SCREW  [SCREW3]  (value not drawn)
R135  value 0  [R0402]  (hidden comment: Resistor_0,062Вт)
R136  value 1М  [R0805]  (hidden comment: Resistor_0,125Вт)
R137  value 0  [R0402]  (hidden comment: Resistor_0,062Вт)
R138  value 0  [R0402]  (hidden comment: Resistor_0,062Вт)
R139  value 0  [R0402]  (hidden comment: Resistor_0,062Вт)
R140  value 34,8к  [R0402]  (hidden comment: Resistor_0,062Вт)
R141  value 4,3к  [R0402]  (hidden comment: Resistor_0,062Вт)
R142  value 154к  [R0402]  (hidden comment: Resistor_0,062Вт)
R143  value 1,2к  [R0402]  (hidden comment: Resistor_0,062Вт)
R144  value 0  [R0402]  (hidden comment: Resistor_0,062Вт)
R145  value 160к  [R0402]  (hidden comment: Resistor_0,062Вт)
R146  value 0  [R0402]  (hidden comment: Resistor_0,062Вт)
R147  value 0  [R0402]  (hidden comment: Resistor_0,062Вт)
R148  value 0  [R0402]  (hidden comment: Resistor_0,062Вт)
R149  value 10к  [R0402]  (hidden comment: Resistor_0,125Вт)
R150  value 150  [R0402]  (hidden comment: Resistor_0,062Вт)
R151  value 3,6к  [R0402]  (hidden comment: Resistor_0,062Вт)
R152  value 2,2к  [R0402]  (hidden comment: Resistor_0,062Вт)
R153  value 15к  [R0402]  (hidden comment: Resistor_0,062Вт)
R154  value 154к  [R0402]  (hidden comment: Resistor_0,062Вт)
R155  value 10к  [R0402]  (hidden comment: Resistor_0,062Вт)
R156  value 3,6к  [R0402]  (hidden comment: Resistor_0,062Вт)
VD20  Part Number: TPSMB56A  [SMB]  (hidden comment: DiodeZener)
VD21  Part Number: TPSMB56A  [SMB]  (hidden comment: DiodeZener)
VD22  Part Number: B560C  [SMC]  (hidden comment: DiodeSchottky)
VD23  Part Number: KPHHS-1005SURCK  [L_0402_RED]  (hidden comment: LED)
VD24  Part Number: B560C  [SMC]  (hidden comment: DiodeSchottky)
VD25  Part Number: KPHHS-1005SURCK  [L_0402_RED]  (hidden comment: LED)
VD26  Part Number: B560C  [SMC]  (hidden comment: DiodeSchottky)
X23  Part Name: Mighty-SPOX  Part Number: 532580529  [MOLEX_532580529]  (hidden comment: Header_5_sct)

### Nets
+1,8B: DA4.5(OUT) R144.1 R146.1
+1,8BA: R146.2
+1,8BD: R144.2
+2B: C162.1 C163.1 L6.2 R138.1 R139.1 R153.2
+2BA: R139.2
+2BD: R138.2
+3,3B: C155.1 C159.2 C160.1 DA4.1(IN) DA4.3(EN) L5.2 R135.1 R137.1 R149.2 R150.2
+3,3BA: R137.2
+3,3BD: R135.2
+24B: C145.1 C146.1 C156.2 C157.2 C158.2 DD12.7(Vin) L4.2 R140.2 VD23.2(A)
+48B: C135.2 C136.2 C137.2 C138.2 C147.2 C148.2 C149.2 C150.2 C164.2 C165.2 C166.2 C167.2 DD11.2(Vin) DD13.2(Vin) L3.4
AGND: R148.2
DGND: C154.2 C155.2 DA4.2(GND) R147.2
EGND: C143.2 M1.1 M2.1 M3.1 M4.1 M5.1 M6.1 M7.1 R136.2 X23.5
PGND: C135.1 C136.1 C137.1 C138.1 C143.1 C145.2 C146.2 C147.1 C148.1 C149.1 C150.1 C151.1 C152.1 C156.1 C157.1 C158.1 C159.1 C160.2 C162.2 C163.2 C164.1 C165.1 C166.1 C167.1 C168.1 C169.1 DD11.7(GND) DD11.9(PWRPAD) DD12.6(GND) DD12.9(PWRPAD) DD13.7(GND) DD13.9(PWRPAD) L3.3 R136.1 R141.1 R142.1 R143.1 R147.1 R148.1 R152.1 R154.1 R155.1 VD22.2(A) VD24.2(A) VD25.1(K) VD26.2(A)
NetC139_1: C139.1 C140.1 C141.1 C142.1 L3.2 VD20.1(K) VD21.1(K) X23.1 X23.2
NetC139_2: C139.2 C140.2 C141.2 C142.2 L3.1 VD20.2(A) VD21.2(A) X23.3 X23.4
NetC144_1: C144.1 DD11.8(SW) L4.1 VD22.1(K)
NetC144_2: C144.2 DD11.1(BOOT)
NetC151_2: C151.2 DD11.6(COMP) R145.2
NetC152_2: C152.2 R145.1
NetC153_1: C153.1 DD12.8(PH) L5.1 VD24.1(K)
NetC153_2: C153.2 DD12.1(BOOT)
NetC154_1: C154.1 DA4.4(NR/FB)
NetC161_1: C161.1 DD13.8(SW) L6.1 VD26.1(K)
NetC161_2: C161.2 DD13.1(BOOT)
NetC168_2: C168.2 DD13.6(COMP) R156.2
NetC169_2: C169.2 R156.1
NetDD11_4: DD11.4(RT/CLK) R142.2
NetDD11_5: DD11.5(FB) R140.1 R143.2
NetDD12_4: DD12.4(SEN) R149.1 R151.2
NetDD13_4: DD13.4(RT/CLK) R154.2
NetDD13_5: DD13.5(FB) R153.1 R155.2
NetR141_2: R141.2 VD23.1(K)
NetR150_1: R150.1 VD25.2(A)
NetR151_1: R151.1 R152.2

Not connected (* = marked no-connect by the designer): DD11 3(EN)*; DD12 2(NC)* 3(NC)* 5(ENA)*; DD13 3(EN)*

### Notes on the sheet
- 24 B - 0,5 А
  3,3 B - 3 А
  2 В - 2 А (+0,5)
  1,8 В - 0,5 А
  Общий ток: 6 А
- Лучше произолировать питание от внешней сети преобразователем.
  Ибо может случиться все, что угодно.
- Вход питания с платы аккумулятора
- 6А
- Ограничение по максимальному зарядку аккумуляторов 54,6В
- Питание 24В, 3,3В | 3,5А
- 622 кГц
- Питание 3,3В | 3А
- Подп. и дата
- Инв. № дубл.
- Взам. инв. №
- Питание 2В, 1,8В | 2,5А
- Инв. № подл.
- Лист
- Изм.
- № докум.
- Подп.
- Дата
- Копировал
- Формат
- (in symbol connect106) Цепь
- (in symbol pwr12) DC
- (in symbol pwr118) DC
- (in symbol pwr127) DC

### Library data of the parts
C135-C138 = cap179: Конденсатор; Part Name: Ceramic; Manufacture: Murata; Part Number: GRM31CR72E104K; id: cap179; TKE: X7R
C139-C142 = cap300: Конденсатор полярный; Part Name: Electrolit; Manufacture: Panasonic; Part Number: EEU-FS1K121LB; id: cap300; tga: 0.08; Zmax: 0,096Ом; Ripple current: 0,81A
C143 = cap211: Конденсатор; Part Name: Ceramic; Manufacture: Murata; Part Number: GRM21AR72E472KW; id: cap211; TKE: X7R
C144 C154 C155 C161 = cap277: as C122 on sheet MainBoard_PERIPH
  C144 C161: Value: 0,1мк
C145 C163 = cap285: Конденсатор; Part Name: Ceramic; Manufacture: TDK; Part Number: C4532C0G1H154J250KA; id: cap285; TKE: NP0; Value: 0,15мк
C146 = cap304: Конденсатор полярный; Part Name: Electrolit; Manufacture: Panasonic; Part Number: EEH-ZE1V151V; id: cap304; ESR: 27мОм
C147-C150 C164-C167 = cap293: Конденсатор; Part Name: MLCC; Manufacture: TDK; Part Number: C4532X7R2A225M; id: cap293; TKE: X7R; tga: 0,10%; Value: 2,2мк
C151 = cap4: Конденсатор; Part Name: Ceramic; Manufacture: Murata; Part Number: GRM1555C1H5R6C; id: cap4; TKE: NP0; Value: 5,6
C152 = cap25: Конденсатор; Part Name: Ceramic; Manufacture: Murata; Part Number: GRM1555C1H561J; id: cap25; TKE: NP0; Value: 560
C153 C158 C159 = cap42: as C120 on sheet MainBoard_PERIPH; Value: 0,01мк
C156 C157 = cap224: Конденсатор; Part Name: Ceramic; Manufacture: Murata; Part Number: GRM21BZ71H475KE15L; id: cap224; TKE: X7R; Value: 4,7мк
C160 = cap210: Конденсатор полярный; Part Name: Tantal; Manufacture: Vishay; Part Number: 293D107X9016D2TE3; id: cap210
C162 = cap302: Конденсатор полярный; Part Name: Tantal; Part Number: TPSD157K010R0050; id: cap302; ESR: 50мОм
C168 = cap23: Конденсатор; Part Name: Ceramic; Manufacture: Murata; Part Number: GRM1555C1H391J; id: cap23; TKE: NP0; Value: 390
C169 = cap28: Конденсатор; Part Name: Ceramic; Manufacture: Murata; Part Number: GRM1555C1H102J; id: cap28; TKE: NP0; Value: 1000
DA4 = pwr118: 400-mA Low-Dropout Regulator with Reverse Current  Protection; Manufacturer: Texas Instruments; id: pwr118; Input Voltage: 1,7-5,5В; Output Voltage: 1,8B; Dropout Voltage: 75mB; Current: 400mA; Part Name: Low-Dropout Regulator with Reverse Current Protection; Type: Linear
DD11 DD13 = pwr127: 5-A, Wide Input Range, Step-Down Converter; Part Name: Step Down DC-DC Converter with Eco-mode; Manufacturer: Texas Instruments; id: pwr127; Input Voltage: 4,5-60В; Output Voltage: 0,8B-58,8B; Current: 5A; Frequency: 100 kHz-25 MHz; Type: Impulse
DD12 = pwr12: 5-A, Wide Input Range, Step-Down Converter; Manufacturer: Texas Instruments; id: pwr12; Input Voltage: 5,5 - 36B; Output Voltage: Adj; Current: 5A; Part Name: Step-Down Converter; Type: Impulse; Part Number: TPS5450
L3 = ind10: Синфазный дроссель; Part Name: Dual-Winding Shielded Power Inductors; Part Number: SRF0703-1R0M; Manufacture: Bourns; id: ind10; Saturation Current: 7,97A; Resistance: 0,0135Ohm
L4 = ind79: EMI Suppression Filter; Part Name: SMD Power Inductors; Part Number: B82477G4223M000; Manufacture: Epcos; id: ind79; Saturation Current: 4,25A; Resistance: 0,038Ohm
L5 = ind78: EMI Suppression Filter; Part Name: SMD Power Inductors; Part Number: B82477G4153M000; Manufacture: Epcos; id: ind78; Saturation Current: 5,25A; Resistance: 0,027Ohm
L6 = ind95: EMI Suppression Filter; Part Name: SMD Power Inductors; Part Number: SDR1006-4R7ML; Manufacture: Bourns; id: ind95; Saturation Current: 7,3A; Resistance: 0,036Ohm
M1-M7 = connect89: Part Name: Винт М3 с заземлением; id: connect89
R135 R137-R139 R144 R146-R148 = res390: Резистор; Manufacture: Yageo; Part Number: RC0603FR-070RL; id: res390; Accuracy: 0,01; Part Name: Resistor; Power: 0,062Вт
R136 = res149: Резистор; Manufacture: Yageo; Part Number: RC0805FR-071ML; id: res149; Accuracy: 0,01; Part Name: Resistor; Power: 0,125Вт
R140 = res1193: Резистор; Manufacture: Yageo; Part Number: RC0402FR-0734K8L; Accuracy: 0,01; id: res1193; Part Name: Resistor; Power: 0,062Вт
R141 = res285: Резистор; Manufacture: Yageo; Part Number: RC0402FR-074K3; id: res285; Accuracy: 0,01; Part Name: Resistor; Power: 0,062Вт
R142 R154 = res1211: Резистор; Manufacture: Yageo; Part Number: RC0402FR-07154KL; Accuracy: 0,01; id: res1211; Part Name: Resistor; Power: 0,062Вт
R143 = res272: Резистор; Manufacture: Yageo; Part Number: RC0402FR-071K2; id: res272; Accuracy: 0,01; Part Name: Resistor; Power: 0,062Вт
R145 = res323: Резистор; Manufacture: Yageo; Part Number: RC0402FR-07160KL; id: res323; Accuracy: 0,01; Part Name: Resistor; Power: 0,062Вт
R149 = res97: Резистор; Manufacture: Yageo; Part Number: RC0805FR-0710KL; id: res97; Accuracy: 0,01; Part Name: Resistor; Power: 0,125Вт
R150 = res250: Резистор; Manufacture: Yageo; Part Number: RC0402FR-07150RL; id: res250; Accuracy: 0,01; Part Name: Resistor; Power: 0,062Вт
R151 R156 = res283: Резистор; Manufacture: Yageo; Part Number: RC0402FR-072K6; id: res283; Accuracy: 0,01; Part Name: Resistor; Power: 0,062Вт
R152 = res278: Резистор; Manufacture: Yageo; Part Number: RC0402FR-072K2; id: res278; Accuracy: 0,01; Part Name: Resistor; Power: 0,062Вт
R153 = res491: Резистор; Manufacture: Yageo; Part Number: RC0603FR-0715KL; id: res491; Accuracy: 0,01; Part Name: Resistor; Power: 0,062Вт
R155 = res487: Резистор; Manufacture: Yageo; Part Number: RC0603FR-0710KL; id: res487; Accuracy: 0,01; Part Name: Resistor; Power: 0,062Вт
VD20 VD21 = TPSMB56A: Cтабилитрон (лавинный выпрямительный диод) односторонний; Part Name: TVS diode Unidirectional; Manufacture: Littelfuse; id: tvs285; Leakage Current: 8uA; Stand-off Voltage: 56B; Breakdown Voltage: 58,8B; Clamping voltage: 77B; Peak Pulse Power: 600W; Number of diodes: 1
VD22 VD24 VD26 = diode32: Диод Шоттки; Part Name: SCHOTTKY BARRIER RECTIFIER; Manufacture: Diodes Incorporated; Max Reverse Voltage: 60B; Forward Voltage: 0,7B; Forward Current: 5A; Leakage current: 20mA; Capacitance: 300pF; Number of Channels: 1; id: diode32; Breakdown Voltage: 60B; Temp MAX: +150; Temp MIN: -55
VD23 VD25 = diode28: Светодиод; Part Name: LED red; id: diode28
X23 = connect106: Разъем - 5 конт. розетка; Manufacture: Molex; Contact_1: +48B; Contact_3: PGND; Contact_5: EGND; Etch: 3.5mm; Contact_2: +48B; Contact_4: PGND; id: connect106

## Sheet MainBoard_KONZEVIC.SchDoc
size 420 x 297 mm; DocumentNumber: VSL.23-MOTHERBOARD; SheetNumber: 8; Format: A3
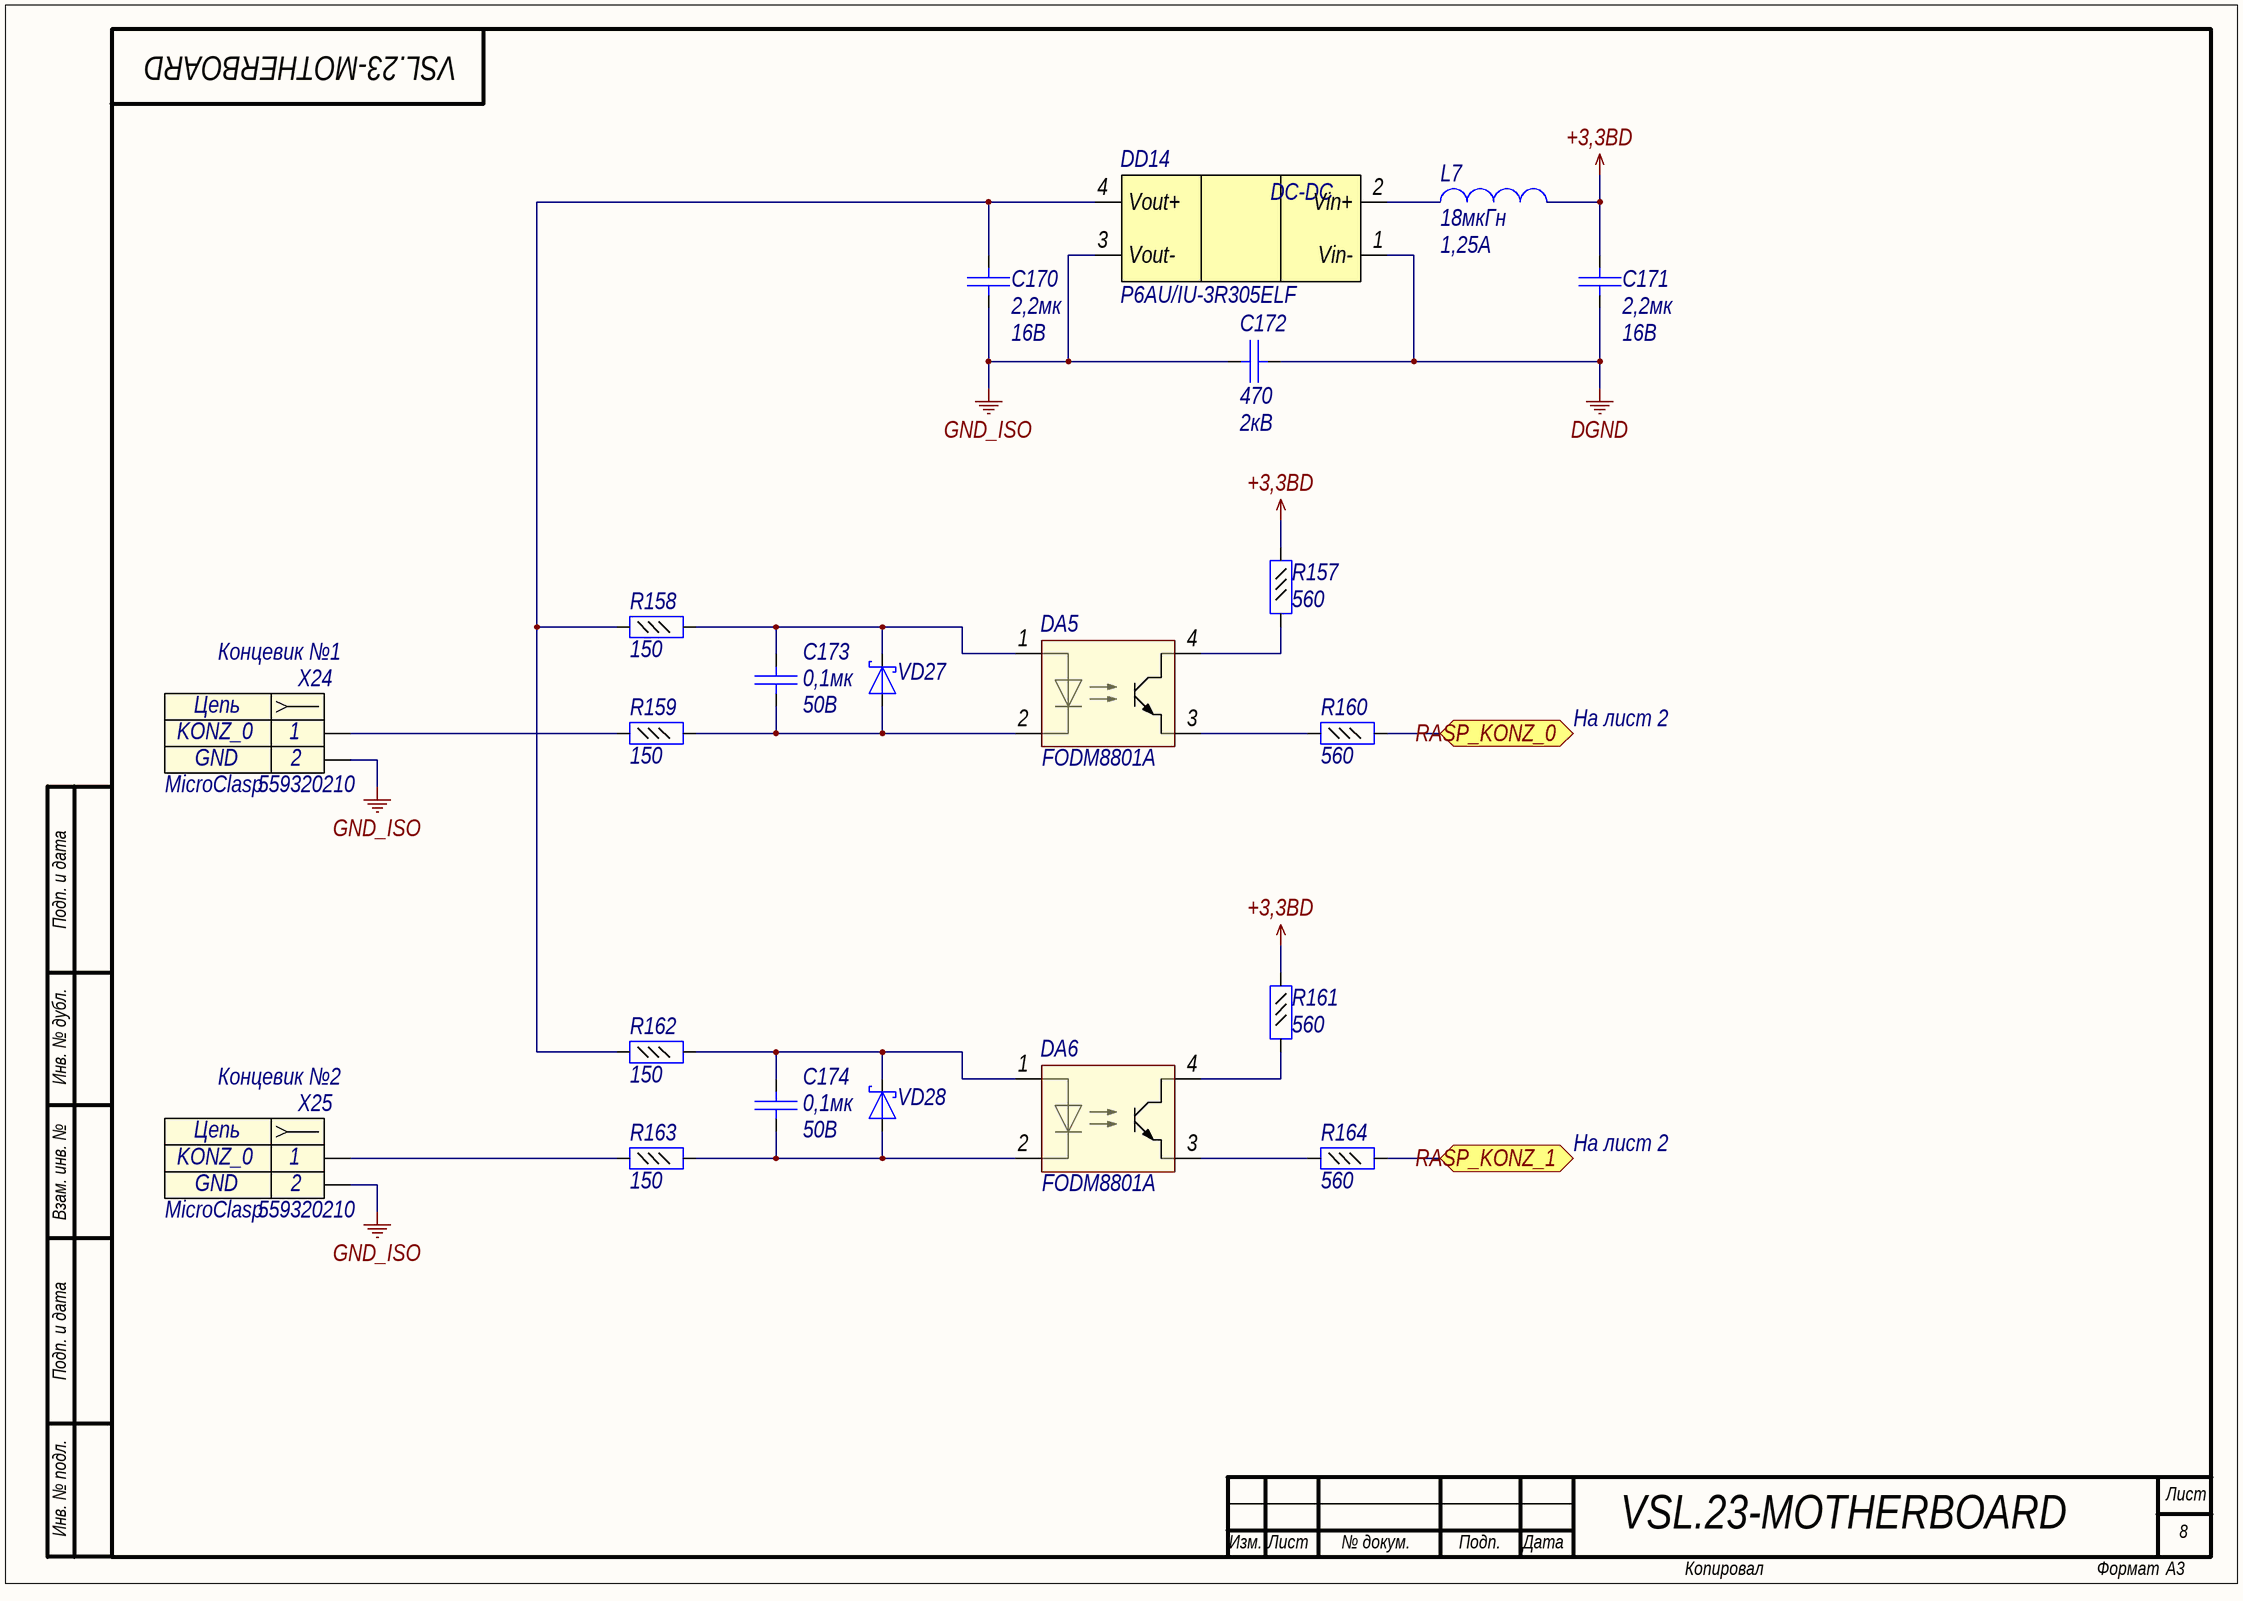
[diagram p7: MainBoard_KONZEVIC.SchDoc]

### Parts
C170  Voltage: 16B  [C0603]  (hidden comment: 2,2мк)
C171  Voltage: 16B  [C0603]  (hidden comment: 2,2мк)
C172  value 470  Voltage: 2кВ  [C1206]  (hidden comment: Capacitor)
C173  value 0,1мк  Voltage: 50В  [C0402]  (hidden comment: Capacitor)
C174  value 0,1мк  Voltage: 50В  [C0402]  (hidden comment: Capacitor)
DA5  Part Number: FODM8801A  [Miniflat4]  (hidden comment: OPTO-1)
DA6  Part Number: FODM8801A  [Miniflat4]  (hidden comment: OPTO-1)
DD14  Part Number: P6AU/IU-3R305ELF  [SIP4]  (hidden comment: P6AU-xxxxELF)
L7  value 18мкГн  Rated Current: 1,25A  [SDR0604]  (hidden comment: Inductor)
R157  value 560  [R0402]  (hidden comment: Resistor_0,062Вт)
R158  value 150  [R0402]  (hidden comment: Resistor_0,062Вт)
R159  value 150  [R0402]  (hidden comment: Resistor_0,062Вт)
R160  value 560  [R0402]  (hidden comment: Resistor_0,062Вт)
R161  value 560  [R0402]  (hidden comment: Resistor_0,062Вт)
R162  value 150  [R0402]  (hidden comment: Resistor_0,062Вт)
R163  value 150  [R0402]  (hidden comment: Resistor_0,062Вт)
R164  value 560  [R0402]  (hidden comment: Resistor_0,062Вт)
VD27  DiodeSchottky  [SOD-123]  (value not drawn)
VD28  DiodeSchottky  [SOD-123]  (value not drawn)
X24  Концевик №1  Part Name: MicroClasp  Part Number: 559320210  [MOLEX_559320210]
X25  Концевик №2  Part Name: MicroClasp  Part Number: 559320210  [MOLEX_559320210]

### Ports
RASP_KONZ_0, RASP_KONZ_1

### Nets
+3,3BD: C171.2 L7.1 R157.1 R161.1
DGND: C171.1 C172.1 DD14.1(Vin-)
GND_ISO: C170.1 C172.2 DD14.3(Vout-) X24.2 X25.2
NetC170_2: C170.2 DD14.4(Vout+) R158.1 R162.1
NetC173_1: C173.1 DA5.2 R159.2 VD27.2(A)
NetC173_2: C173.2 DA5.1 R158.2 VD27.1(K)
NetC174_1: C174.1 DA6.2 R163.2 VD28.2(A)
NetC174_2: C174.2 DA6.1 R162.2 VD28.1(K)
NetDA5_3: DA5.3 R160.1
NetDA5_4: DA5.4 R157.2
NetDA6_3: DA6.3 R164.1
NetDA6_4: DA6.4 R161.2
NetDD14_2: DD14.2(Vin+) L7.2
NetR159_1: R159.1 X24.1
NetR160_2: R160.2 ; port RASP_KONZ_0
NetR163_1: R163.1 X25.1
NetR164_2: R164.2 ; port RASP_KONZ_1

### Notes on the sheet
- На лист 2
- Подп. и дата
- Инв. № дубл.
- Взам. инв. №
- Инв. № подл.
- Лист
- Изм.
- № докум.
- Подп.
- Дата
- Копировал
- Формат
- (in symbol connect95) Цепь
- (in symbol pwr54) DC-DC

### Library data of the parts
C170 C171 = cap287: Конденсатор; Part Name: Ceramic; Manufacture: Murata; Part Number: GRM188Z71C225ME43J; id: cap287; TKE: X7R; tga: 0,10%; Value: 2,2мк
C172 = cap284: Конденсатор; Part Name: Ceramic; Manufacture: Yageo; Part Number: CC1206KKX7RDBB471; id: cap284; TKE: X7R
C173 C174 = cap277: as C122 on sheet MainBoard_PERIPH
DA5 DA6 = FODM8801A: Опторазвязка; Manufacturer: ON Semiconductor; id: opto2; Forward current: 20мА; Forward Voltage: 1,8B; Reverse voltage: 6B; Continuous collector current: 30mA; Voltage coll-emmiter: 75B; Max tempreture: +125; Min tempreture: -40; Power dissipation: 300mW
DD14 = pwr54: DC/DC преобразователь; Part Name: DC/DC Converter Isolated; Manufacturer: PEAK Electronics; id: pwr54; Input Voltage: 3,3B; Output Voltage: 5B; Current: 200mA; Type: Isolated
L7 = ind45: EMI Suppression Filter; Part Name: SMD Power Inductors; Part Number: SDR0604- 180YL; Manufacture: Bourns; id: ind45; Saturation Current: 1,5A; Resistance: 0,15Ohm
R157 R160 R161 R164 = res264: as R107 on sheet MainBoard_PERIPH; Part Name: Resistor; Power: 0,062Вт
R158 R159 R162 R163 = res250: as R150 on sheet MainBoard_PWR; Part Name: Resistor; Power: 0,062Вт
VD27 VD28 = diode27: Диод Шоттки; Part Number: MBR2H100SFT3G; Manufacture: ON Semiconductor; Max Reverse Voltage: 100B; Forward Current: 2А; Breakdown Current: 0,5mA; Number of Channels: 1; id: diode27; Part Name: Diode Schottky; Breakdown Voltage: 100B
X24 X25 = connect95: Разъем - 2 конт. розетка; Manufacture: Molex; Contact_1: KONZ_0; Contact_2: GND; Etch: 2mm; id: connect95

## Nets that join several sheets
+1,8BA: MainBoard_ETH_RASP (6 pins), MainBoard_PWR (R146.2)
+1,8BD: MainBoard_ETH_RASP (C117.2 DD8.62), MainBoard_PWR (R144.2)
+2BA: MainBoard_ETH (55 pins), MainBoard_PWR (R139.2)
+2BD: MainBoard_ETH (14 pins), MainBoard_PWR (R138.2)
+3,3BA: MainBoard_ETH_RASP (14 pins), MainBoard_PWR (R137.2)
+3,3BD: MainBoard_MCU (35 pins), MainBoard_ETH (28 pins), MainBoard_ETH_RASP (24 pins), MainBoard_PERIPH (23 pins), MainBoard_RELAY (8 pins), MainBoard_PWR (R135.2), MainBoard_KONZEVIC (C171.2 L7.1 R157.1 R161.1)
+24B: MainBoard_PERIPH (VT2.3 VT4.3), MainBoard_RELAY (8 pins), MainBoard_PWR (9 pins)
+48B: MainBoard_ETH (8 pins), MainBoard_PWR (15 pins)
AGND: MainBoard_ETH (77 pins), MainBoard_ETH_RASP (12 pins), MainBoard_PWR (R148.2)
DGND: MainBoard_MCU (35 pins), MainBoard_RASP (79 pins), MainBoard_ETH (37 pins), MainBoard_ETH_RASP (13 pins), MainBoard_PERIPH (27 pins), MainBoard_RELAY (8 pins), MainBoard_PWR (C154.2 C155.2 DA4.2 R147.2), MainBoard_KONZEVIC (C171.1 C172.1 DD14.1)
EGND: MainBoard_MCU (X2.4 X3.4), MainBoard_ETH (X5.9 X6.9 X7.9 X8.9), MainBoard_PERIPH (5 pins), MainBoard_RELAY (8 pins), MainBoard_PWR (10 pins)
PGND: MainBoard_ETH (8 pins), MainBoard_PERIPH (VT2.1 VT4.1 X11.2 X13.2), MainBoard_RELAY (16 pins), MainBoard_PWR (46 pins)
NetDD1_8: MainBoard_MCU (DD1.8), MainBoard_RELAY (R127.1)
NetDD1_9: MainBoard_MCU (DD1.9), MainBoard_RELAY (R129.1)
NetDD1_10: MainBoard_MCU (DD1.10), MainBoard_RELAY (R131.1)
NetDD1_11: MainBoard_MCU (DD1.11), MainBoard_RELAY (R133.1)
NetDD1_20: MainBoard_MCU (DD1.20 R2.1), MainBoard_RASP (X4.27)
NetDD1_21: MainBoard_MCU (DD1.21 DD2.6), MainBoard_RASP (X4.35), MainBoard_PERIPH (R115.2)
NetDD1_22: MainBoard_MCU (DD1.22 DD2.2), MainBoard_RASP (X4.29), MainBoard_PERIPH (R118.2)
NetDD1_23: MainBoard_MCU (DD1.23 DD2.5), MainBoard_RASP (X4.33), MainBoard_PERIPH (R117.2)
NetDD1_24: MainBoard_MCU (DD1.24), MainBoard_RELAY (R128.1)
NetDD1_25: MainBoard_MCU (DD1.25), MainBoard_RELAY (R130.1)
NetDD1_37: MainBoard_MCU (DD1.37), MainBoard_RELAY (R132.1)
NetDD1_38: MainBoard_MCU (DD1.38), MainBoard_RELAY (R134.1)
NetDD6_5: MainBoard_ETH (DD6.5), MainBoard_ETH_RASP (DD8.52)
NetDD6_6: MainBoard_ETH (DD6.6), MainBoard_ETH_RASP (DD8.53)
NetDD6_9: MainBoard_ETH (DD6.9), MainBoard_ETH_RASP (DD8.55)
NetDD6_10: MainBoard_ETH (DD6.10), MainBoard_ETH_RASP (DD8.56)
NetL2_3: MainBoard_RASP (X4.165), MainBoard_ETH_RASP (L2.3)
NetL2_4: MainBoard_RASP (X4.167), MainBoard_ETH_RASP (L2.4)
NetR102_2: MainBoard_RASP (X4.53), MainBoard_PERIPH (R102.2)
NetR103_2: MainBoard_RASP (X4.51), MainBoard_PERIPH (R103.2)
NetR104_2: MainBoard_RASP (X4.57), MainBoard_PERIPH (R104.2)
NetR110_1: MainBoard_RASP (X4.63), MainBoard_PERIPH (R110.1 SW5.3)
NetR111_1: MainBoard_RASP (X4.59), MainBoard_PERIPH (R111.1 SW5.4)
NetR112_1: MainBoard_RASP (X4.89), MainBoard_PERIPH (R112.1)
NetR113_2: MainBoard_RASP (X4.47), MainBoard_PERIPH (R113.2 R120.2)
NetR114_2: MainBoard_RASP (X4.45), MainBoard_PERIPH (R114.2 R119.2)
NetR116_1: MainBoard_RASP (X4.28), MainBoard_PERIPH (R116.1)
NetR121_2: MainBoard_RASP (X4.46), MainBoard_PERIPH (R121.2)
NetR122_2: MainBoard_RASP (X4.48), MainBoard_PERIPH (R122.2)
NetR123_1: MainBoard_RASP (X4.87), MainBoard_PERIPH (R123.1 X14.2)
NetR124_2: MainBoard_RASP (X4.65), MainBoard_PERIPH (R124.2)
NetR125_2: MainBoard_RASP (X4.64), MainBoard_PERIPH (R125.2)
NetR126_2: MainBoard_RASP (X4.66), MainBoard_PERIPH (R126.2)
NetR160_2: MainBoard_RASP (X4.11), MainBoard_KONZEVIC (R160.2)
NetR164_2: MainBoard_RASP (X4.15), MainBoard_KONZEVIC (R164.2)